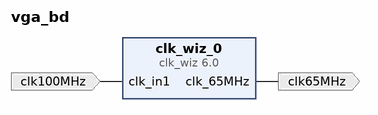
[diagram p0: block diagram of the top level]
# Vivado block design vga_bd, xc7z020clg484-1, Vivado 2022.2
create_bd_design vga_bd

create_bd_port -dir I clk100MHz
create_bd_port -dir O clk65MHz

create_bd_cell -type ip -vlnv xilinx.com:ip:clk_wiz:6.0 clk_wiz_0
set_property -dict [list \
  CONFIG.CLKOUT1_JITTER 254.866 \
  CONFIG.CLKOUT1_PHASE_ERROR 297.890 \
  CONFIG.CLKOUT1_REQUESTED_OUT_FREQ 65.000 \
  CONFIG.CLK_OUT1_PORT clk_65MHz \
  CONFIG.MMCM_CLKFBOUT_MULT_F 50.375 \
  CONFIG.MMCM_CLKOUT0_DIVIDE_F 15.500 \
  CONFIG.MMCM_DIVCLK_DIVIDE 5 \
  CONFIG.USE_LOCKED false \
  CONFIG.USE_RESET false \
] [get_bd_cells clk_wiz_0]

# ---- connections ----

connect_bd_net [get_bd_ports clk100MHz] [get_bd_pins clk_wiz_0/clk_in1]
connect_bd_net [get_bd_pins clk_wiz_0/clk_65MHz] [get_bd_ports clk65MHz]

validate_bd_design
save_bd_design
